# Altium schematic sheet 05_POWER.SchDoc
size 420 x 297 mm; Web: www.byte-lab.com; PageNumber: 05
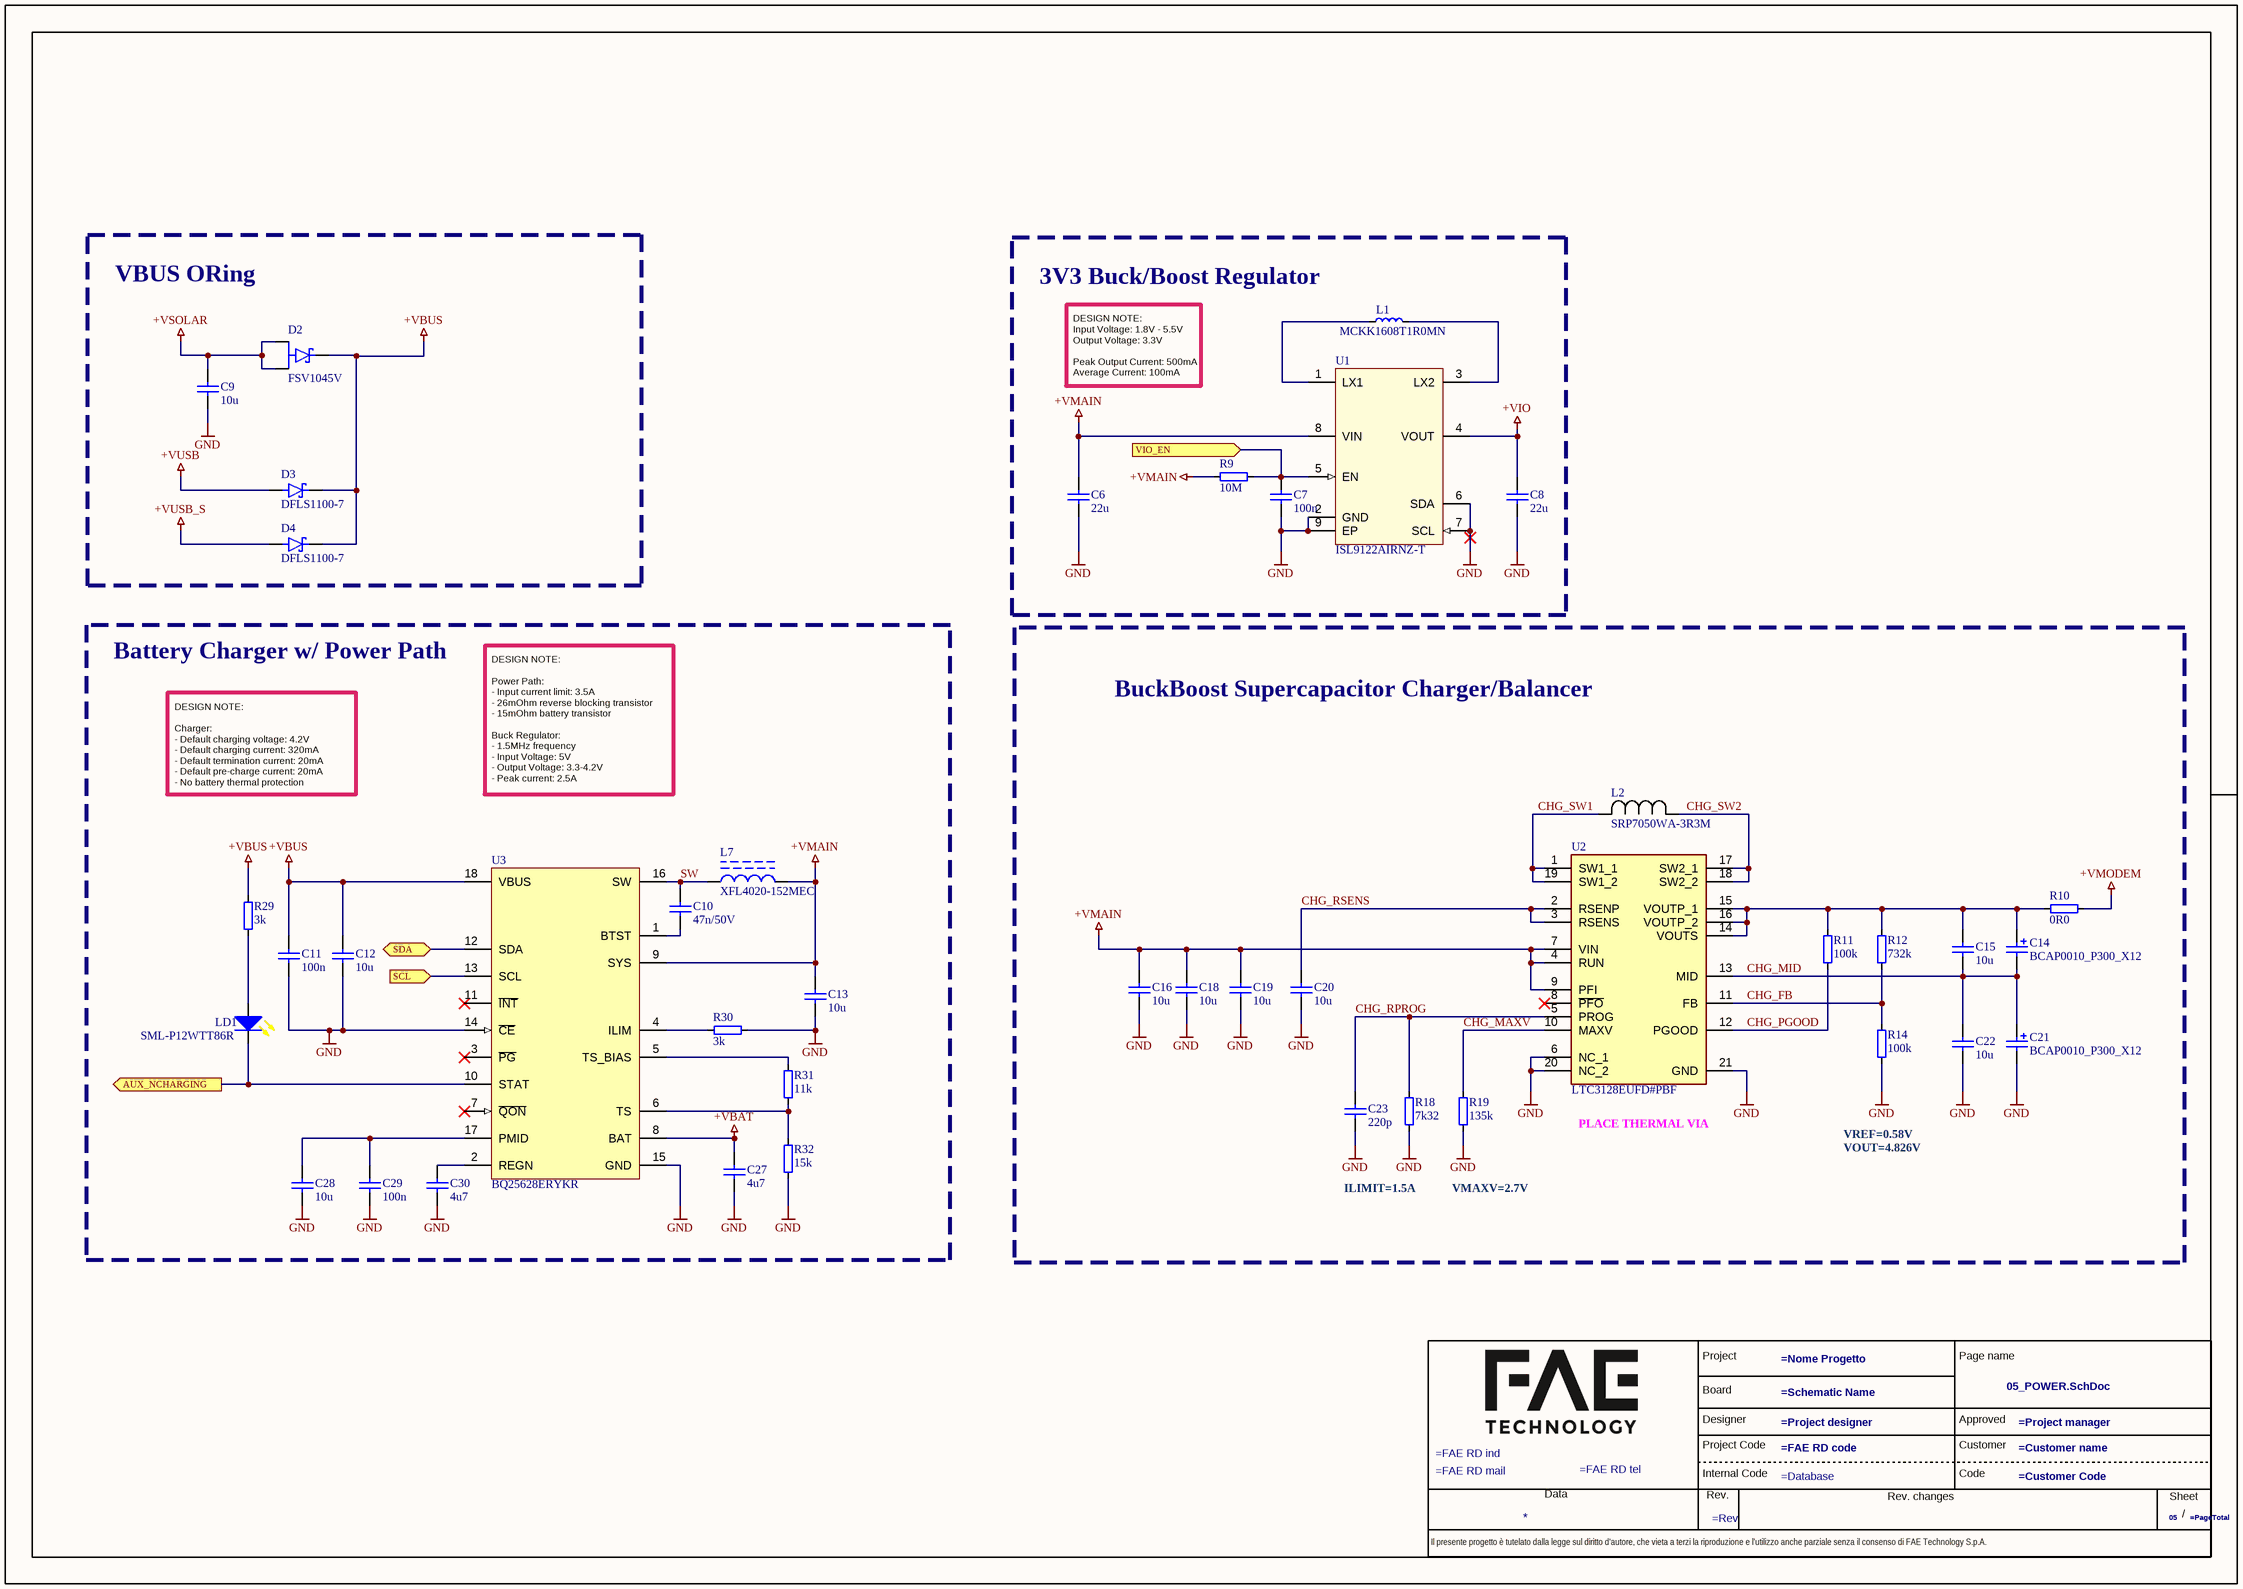
[diagram p0: 05_POWER.SchDoc]

## Parts
?  (no value)  (graphical)
C6  22u  [C-0805]
C7  100n  [C-0402]
C8  22u  [C-0805]
C9  10u  [C-1206]
C10  47n/50V  [C-0402]
C11  100n  [C-0603]
C12  10u  [C-1206]
C13  10u  [C-1206]
C14  BCAP0010_P300_X12  [BCAP0010P300X12]
C15  10u  [C-1206]
C16  10u  [C-1206]
C18  10u  [C-1206]
C19  10u  [C-1206]
C20  10u  [C-1206]
C21  BCAP0010_P300_X12  [BCAP0010P300X12]
C22  10u  [C-1206]
C23  220p  [C-0402]
C27  4u7  [C-0603]
C28  10u  [C-0805]
C29  100n  [C-0402]
C30  4u7  [C-0603]
D2  FSV1045V  [DIO_FSV1045V]
D3  DFLS1100-7  [DIO_DFLS1100-7]
D4  DFLS1100-7  [DIO_DFLS1100-7]
L1  MCKK1608T1R0MN  [L-0603]
L2  SRP7050WA-3R3M  [IND_SRP7050_BRN]
L7  XFL4020-152MEC  [IND_XFL4020]
LD1  SML-P12WTT86R  [LED-0402]
R9  10M  [R-0402]
R10  0R0  [R-0603]
R11  100k  [R-0402]
R12  732k  [R-0402]
R14  100k  [R-0402]
R18  7k32  [R-0402]
R19  135k  [R-0402]
R29  3k  [R-0402]
R30  3k  [R-0402]
R31  11k  [R-0402]
R32  15k  [R-0402]
U1  ISL9122AIRNZ-T  [DFN50P200X300x75-8T180X165]
U2  LTC3128EUFD#PBF  [QFN50P400X500X80-21N-D]
U3  BQ25628ERYKR  [QFN40P300X150X80-18N]

## Blocks framed on the sheet
VBUS ORing: C9 D2-D4
3V3 Buck/Boost Regulator: C6-C8 L1 R9 U1
Battery Charger w/ Power Path: C10-C13 C27-C30 L7 LD1 R29-R32 U3
BuckBoost Supercapacitor Charger/Balancer: C14-C16 C18-C23 L2 R10-R12 R14 R18 R19 U2

## Ports
AUX_NCHARGING (out), SCL (in), SDA (bidir), VIO_EN (in)

## Nets
+VBAT: C27.2 U3.8(BAT)
+VBUS: C11.2 C12.1 D2.3(K) D3.K D4.K R29.2 U3.18(VBUS)
+VIO: C8.2 U1.4(VOUT)
+VMAIN: C6.2 C13.1 C16.2 C18.2 C19.2 L7.2 R9.1 U1.8(VIN) U2.4(RUN) U2.7(VIN) U2.9(PFI) U3.9(SYS)
+VMODEM: R10.2
+VSOLAR: C9.2 D2.1(A1) D2.2(A2)
+VUSB: D3.A
+VUSB_S: D4.A
GND: C6.1 C7.2 C8.1 C9.1 C11.1 C12.2 C13.2 C16.1 C18.1 C19.1 C20.1 C21.2(-) C22.1 C23.1 C27.1 C28.1 C29.1 C30.1 R14.1 R18.1 R19.1 R30.1 R32.1 U1.2(GND) U1.6(SDA) U1.7(SCL) U1.9(EP) U2.6(NC_1) U2.20(NC_2) U2.21(GND) U3.14(~{CE}) U3.15(GND)
AUX_NCHARGING: LD1.2(K) U3.10(STAT) ; port AUX_NCHARGING
CHG_FB: R12.1 R14.2 U2.11(FB)
CHG_MAXV: R19.2 U2.10(MAXV)
CHG_MID: C14.2(-) C15.1 C21.1(+) C22.2 U2.13(MID)
CHG_PGOOD: R11.2 U2.12(PGOOD)
CHG_RPROG: C23.2 R18.2 U2.5(PROG)
CHG_RSENS: C20.2 U2.2(RSENP) U2.3(RSENS)
CHG_SW1: L2.2 U2.1(SW1_1) U2.19(SW1_2)
CHG_SW2: L2.1 U2.17(SW2_1) U2.18(SW2_2)
SCL: U3.13(SCL) ; port SCL
SDA: U3.12(SDA) ; port SDA
SW: C10.2 L7.1 U3.16(SW)
VIO_EN: C7.1 R9.2 U1.5(EN) ; port VIO_EN
NetC10_1: C10.1 U3.1(BTST)
NetC14_1: C14.1(+) C15.2 R10.1 R11.1 R12.2 U2.14(VOUTS) U2.15(VOUTP_1) U2.16(VOUTP_2)
NetC28_2: C28.2 C29.2 U3.17(PMID)
NetC30_2: C30.2 U3.2(REGN)
NetL1_1: L1.1 U1.1(LX1)
NetL1_2: L1.2 U1.3(LX2)
NetLD1_1: LD1.1(A) R29.1
NetR30_2: R30.2 U3.4(ILIM)
NetR31_1: R31.1 U3.5(TS_BIAS)
NetR31_2: R31.2 R32.2 U3.6(TS)

Not connected (* = marked no-connect by the designer): U2 8(~{PFO})*; U3 3(~{PG})* 7(~{QON})* 11(~{INT})*

## Notes on the sheet
- DESIGN NOTE:
  Input Voltage: 1.8V - 5.5V
  Output Voltage: 3.3V
  Peak Output Current: 500mA
  Average Current: 100mA
- DESIGN NOTE:
  Charger:
  - Default charging voltage: 4.2V
  - Default charging current: 320mA
  - Default termination current: 20mA
  - Default pre-charge current: 20mA
  - No battery thermal protection
- DESIGN NOTE:
  Power Path:
  - Input current limit: 3.5A
  - 26mOhm reverse blocking transistor
  - 15mOhm battery transistor
  Buck Regulator:
  - 1.5MHz frequency
  - Input Voltage: 5V
  - Output Voltage: 3.3-4.2V
  - Peak current: 2.5A
- (near U2) PLACE THERMAL VIA
- VREF=0.58V
- ILIMIT=1.5A
- VMAXV=2.7V
- VOUT=4.826V
- Board
- Project
- Page name
- Project Code
- Designer
- Internal Code
- Approved
- Customer
- Code
- Il presente progetto è tutelato dalla legge sul diritto d'autore, che vieta a terzi la riproduzione e l'utilizzo anche parziale senza il consenso di FAE Technology S.p.A.
- Data
- Rev.
- Rev. changes
- Sheet
- /

## Library data of the parts
? = MyFAETechnology
C6 C8 = C0805-22u-16V-X5R: Capacitor ceramic 22u ±10% X5R 16V 0805; BL Part Number: 2006-222; Manufacturer: Samsung Electro-Mechanics; Manufacturer Part Number: CL21A226KOQNNNG; Drawn_By: Fumic; Checked_By: Hamin; Pkg Type: SMD; DateModified: 28-07-2022; Package: 0805
C7 = C0402-100n-16V-X7R: Capacitor ceramic 100n ±10% X7R 16V 0402; BL Part Number: 2000-908; Manufacturer: Murata Electronics; Manufacturer Part Number: GRM155R71C104KA88D; Drawn_By: Puskar; Checked_By: Dodig; Pkg Type: SMD; DateModified: 27-08-2013; Supplier 1: Digi-Key; Supplier Part Number 1: 490-3261-1-ND; Note: *; Package: 0402
C9 C12 = C1206-10u-35V-X7R: Capacitor ceramic 10u ±10% X7R 35V 1206; Manufacturer: Taiyo Yuden; Manufacturer Part Number: GMK316AB7106KL-TR; Pkg Type: SMD; Note: *; Supplier 1: Digi-Key; Package: 1206
C10 = C0402-47n-50V-X7R: Capacitor ceramic 47n 10% X7R 50V 0402; BL Part Number: 2003-965; Manufacturer: YAGEO; Manufacturer Part Number: CC0402KRX7R9BB473; Drawn_By: Hlupic; Checked_By: Hamin; Pkg Type: SMD; Note: *; DateModified: 08-05-2018; Supplier 1: Digi-Key; Supplier Part Number 1: 311-3815-2-ND; Package: 0402
C11 = C0603-100n-50V-X7R: Capacitor ceramic 100n ±10% X7R 50V 0603; Manufacturer: KEMET; Manufacturer Part Number: C0603C104K5RACTU; Pkg Type: SMD; Note: *; Package: 0603
C13 C15 C16 C18-C20 C22 = C1206-10u-16V-X7R: Capacitor ceramic 10u ±10% X7R 16V 1206; BL Part Number: 2000-447; Manufacturer: Samsung Electro-Mechanics; Manufacturer Part Number: CL31B106KOHNNNE; Drawn_By: Dodig; Checked_By: Zvonc; Pkg Type: SMD; Note: *; DateModified: 04-07-2013; Supplier 1: Digi-Key; Supplier Part Number 1: 1276-1137-1-ND; Package: 1206
C14 C21 = BCAP0010_P300_X12: 10 F  Capacitor 3 V Radial, Can 25mOhm; Manufacturer: Maxwell Technologies; Manufacturer Part Number: BCAP0010 P300 X12; Geometry.Height: 10.5mm; Pkg Type: THT; Mouser Part Number: 723-BCAP0010P300X12; Mouser Price/Stock: https://www.mouser.co.uk/ProductDetail/Maxwell-Technologies/BCAP0010-P300-X12?qs=hzBznG4dWXUp87%2FIMp%252BJ8w%3D%3D; Datasheet Link: *
C23 = C0402-220p-50V-C0G-5: Capacitor ceramic 220p ±5% C0G 50V 0402; Manufacturer: Murata Electronics; Manufacturer Part Number: GRM1555C1H221JA01D; Pkg Type: SMD; Note: *; Package: 0402
C27 C30 = C0603-4u7-10V-X5R: Capacitor ceramic 4u7 ±10% X5R 10V 0603; BL Part Number: 2003-721; Manufacturer: Samsung Electro-Mechanics; Manufacturer Part Number: CL10A475KP8NNNC; Drawn_By: Hamin; Checked_By: Marsic; Pkg Type: SMD; DateModified: 19-06-2023; Note: *; Package: 0603
C28 = C0805-10u-25V-X5R: Capacitor ceramic 10u ±20% X5R 25V 0805; BL Part Number: 2004-293; Manufacturer: Murata Electronics; Manufacturer Part Number: GRM21BR61E106MA73L; Drawn_By: Hlupic; Checked_By: Hamin; Pkg Type: SMD; Note: *; DateModified: 23-01-2019; Supplier 1: Digi-Key; Supplier Part Number 1: 490-10748-1-ND; Package: 0805
C29 = C0402-100n-25V-X5R: Capacitor ceramic 100n ±10% X5R 25V 0402; BL Part Number: 2004-296; Manufacturer: Samsung Electro-Mechanics; Manufacturer Part Number: CL05A104KA5NNNC; Drawn_By: PuskarJ; Checked_By: Hamin; Pkg Type: SMD; Note: *; DateModified: 24-01-2019; Supplier 1: Digi-Key; Supplier Part Number 1: 1276-1043-1-ND; Package: 0402
D2 = FSV1045V: Diode Schottky 10A 45V TO2773 | onsemi FSV1045V; Pkg Type: SMD; Package: TO-2773; Value: *; Manufacturer: onsemi; Manufacturer Part Number: FSV1045V
D3 D4 = DFLS1100-7: Diode Schottky 1A 100V PowerDI 123 | Diodes Inc DFLS1100-7; Manufacturer: Diodes Inc.; Pkg Type: SMD; Package: POWERDI123; Value: *; Manufacturer Part Number: DFLS1100-7
L1 = L0603-1u-20 MCKK1608T1R0MN: Inductor 0603 1u ±20% 1.3A; Manufacturer: Taiyo Yuden; BL Part Number: 2003-989; Checked_By: Hlupic; Drawn_By: Fumic; Manufacturer Part Number: MCKK1608T1R0MN; DateModified: 30-01-2020; Note: *; Supplier 1: Digi-Key; Supplier Part Number 1: 587-5973-1-ND
L2 = SRP7050WA-3R3M: 3.3 µH Inductor Shielded 11.5 A 15mohm max; Manufacturer: Bourns Electronics; Type: Fixed Inductors; Pkg Type: SMD; Manufacturer Part Number: SRP7050WA-3R3M; Package: 7.90mm x 7.30mm
L7 = Inductor XFL4020-152MEC: Inductor 1u5 ±20% 4.6A SMD; Manufacturer: Coilcraft; BL Part Number: 2006-846; Checked_By: Hlupic; Drawn_By: Marsic; Manufacturer Part Number: XFL4020-152MEC; DateModified: 29-09-2022; Note: *; Pkg Type: SMD
LD1 = LED_SML-P12WTT86R: LED YELLOW CLEAR 0402 SMD; Manufacturer: ROHM Semiconductor; BL Part Number: 2007-660; Drawn_By: Hamin; Note: *; DateModified: 19-06-23; Checked_By: Hamin; Manufacturer Part Number: SML-P12WTT86R; Pkg Type: SMD
R9 = R0402-10M-1: Resistor 10M ±1% 0402; Manufacturer Part Number: RC0402FR-0710ML; Manufacturer: YAGEO; BL Part Number: 2002-832; Checked_By: Dodig; Drawn_By: Zvonc; Pkg Type: SMD; DateModified: 24-05-2016; Note: *; Supplier 1: Digi-Key; Supplier Part Number 1: RC0402FR-0710ML; Package: 0402
R10 = R0603-0R0: Resistor 0R0 0603; Manufacturer Part Number: RC0603JR-070RL; Manufacturer: YAGEO; BL Part Number: 2000-723; Checked_By: Puskar; Drawn_By: Dodig; Pkg Type: SMD; DateModified: 07-12-2013; Note: *; Package: 0603
R11 R14 = R0402-100k-1: Resistor 100k ±1% 0402; Manufacturer Part Number: RC0402FR-07100KL; Manufacturer: YAGEO; Pkg Type: SMD; Note: *; Package: 0402
R12 = R0402-732k-1: Resistor 732k ±1% 0402; Manufacturer Part Number: RC0402FR-07732KL; Manufacturer: YAGEO; Pkg Type: SMD; Note: *; Package: 0402
R18 = R0402-7k32-1: Resistor 7k32 ±1% 0402; Manufacturer Part Number: RC0402FR-077K32L; Manufacturer: YAGEO; Pkg Type: SMD; Note: *; Supplier 1: Digi-Key; Package: 0402
R19 = R0402-135k-1: Resistor 135k ±1% 0402; Manufacturer Part Number: RN73H1ETTP1353F50; Manufacturer: KOA Speer Electronics, Inc.; Pkg Type: SMD; Note: *; Supplier 1: Digi-Key; Package: 0402
R29 R30 = R0402-3k-1: Resistor 3k ±1% 0402; Manufacturer: YAGEO; BL Part Number: 2001-570; Checked_By: Hamin; Drawn_By: Fumic; Pkg Type: SMD; Manufacturer Part Number: -; DateModified: 06-09-2021; Note: *; Package: 0402
R31 = R0402-11k-1: Resistor 11k ±1% 0402; Manufacturer Part Number: RC0402FR-0711KP; Manufacturer: YAGEO; BL Part Number: 2004-237; Checked_By: Marsic; Drawn_By: PuskarJ; Pkg Type: SMD; DateModified: 18-12-2018; Note: *; Package: 0402
R32 = R0402-15k-1: Resistor 15k ±1% 0402; Manufacturer: Panasonic Electronic Components; Manufacturer Part Number: ERJ-2RKF1502X; BL Part Number: 2001-157; Checked_By: Zvonc; Drawn_By: Puskar; Pkg Type: SMD; Supplier 1: Digi-Key; Supplier Part Number 1: P15.0KLCT-ND; DateModified: 23-01-2015; Note: *; Package: 0402
U1 = ISL9122AIRNZ-T: IC CON BUCK-BOOST ADJ 0.5A DFN-8; Manufacturer: Renesas; BL Part Number: 2008-968; Drawn_By: Marsic; Manufacturer Part Number: ISL9122AIRNZ-T; DateModified: 19-11-2024; Checked_By: *; Note: *
U2 = LTC3128EUFD#PBF: IC REG BuckBoost Supercapacitor Charger and Balancer ADJ 3A 20QFN; Manufacturer: Analog Devices; Geometry.Height: 0.8mm; Pkg Type: SMD; Datasheet Link: https://www.analog.com/en/products/ltc3128.html; Manufacturer Part Number: LTC3128EUFD#PBF; Package: QFN20
U3 = BQ25628ERYKR: IC LI-ION CHARGE MGMT 16-QFN; Manufacturer: Texas Instruments; BL Part Number: 2008-206; Drawn_By: Marsic; Pkg Type: SMD; Checked_By: *; DateModified: 17-01-2024; Manufacturer Part Number: BQ25628ERYKR; Note: *; Supplier 1: Digi-Key; Supplier Part Number 1: 296-BQ25628ERYKRCT-ND - Cut Tape (CT)